# EAGLE design H3_MIDIController_Rev_3_MainBoard (EAGLE 7.6.0)
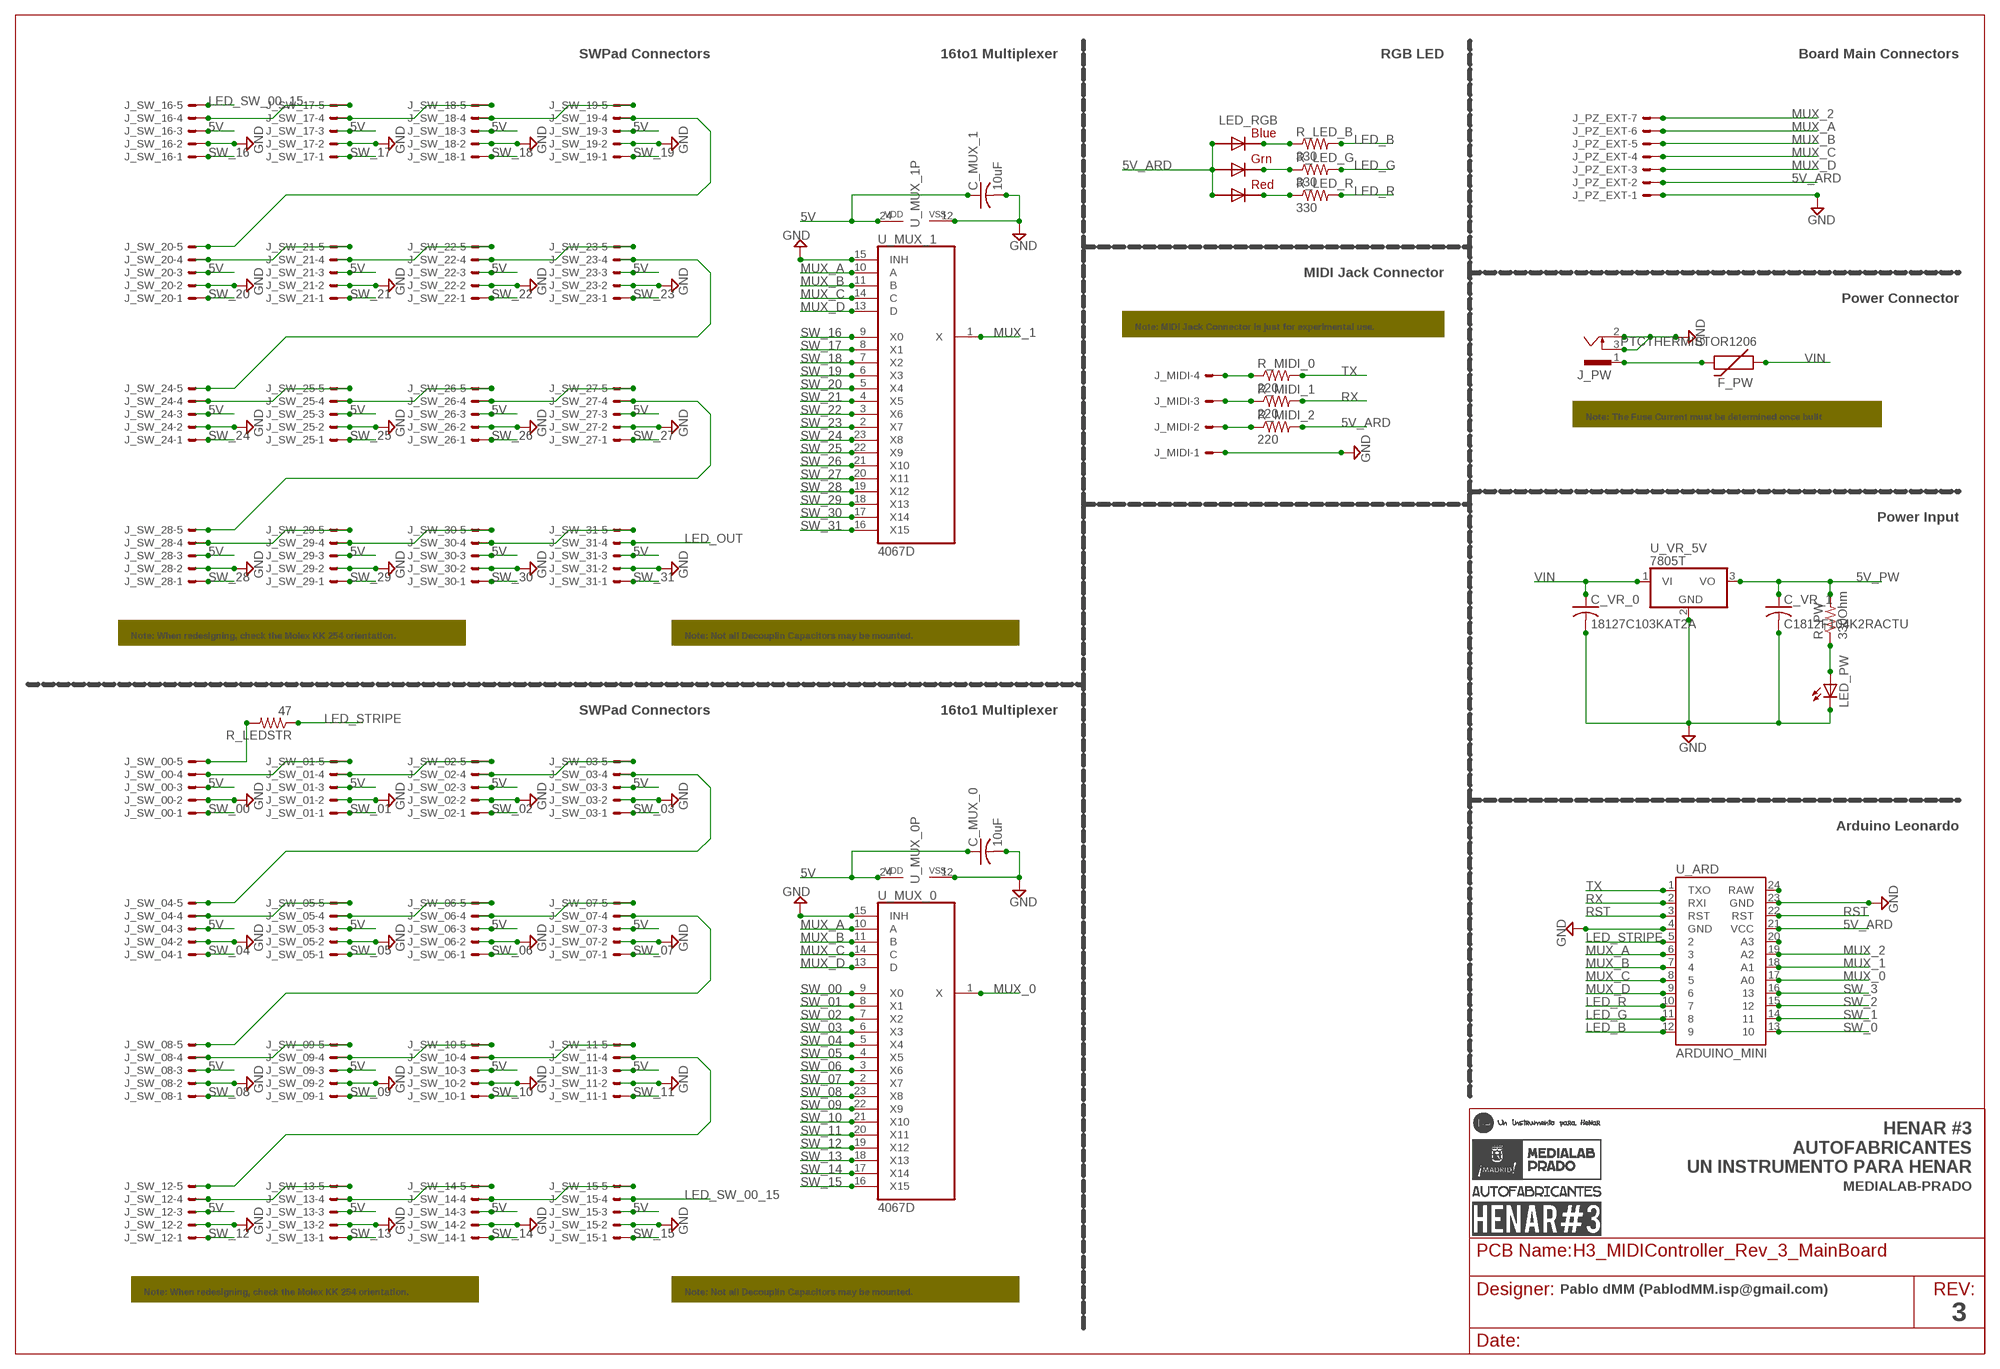
[diagram p0: schematic, sheet 1]

## Parts
C_MUX_0  10uF  C-USC1206K  [C1206K]
C_MUX_1  10uF  C-USC1206K  [C1206K]
C_VR_0  18127C103KAT2A  C-USC1812K  [C1812K]
C_VR_1  C1812F104K2RACTU  C-USC1812K  [C1812K]
F_PW  PTCTHERMISTOR1206  [PTC-1206]
J_MIDI  22-05-7048-04  [7395-04]
J_PW  SCD-014A  [SCD-014-A]
J_PZ_EXT  22-05-7078-07  [7395-07]
J_SW_00  22-05-7058-05  [7395-05]
J_SW_01  22-05-7058-05  [7395-05]
J_SW_02  22-05-7058-05  [7395-05]
J_SW_03  22-05-7058-05  [7395-05]
J_SW_04  22-05-7058-05  [7395-05]
J_SW_05  22-05-7058-05  [7395-05]
J_SW_06  22-05-7058-05  [7395-05]
J_SW_07  22-05-7058-05  [7395-05]
J_SW_08  22-05-7058-05  [7395-05]
J_SW_09  22-05-7058-05  [7395-05]
J_SW_10  22-05-7058-05  [7395-05]
J_SW_11  22-05-7058-05  [7395-05]
J_SW_12  22-05-7058-05  [7395-05]
J_SW_13  22-05-7058-05  [7395-05]
J_SW_14  22-05-7058-05  [7395-05]
J_SW_15  22-05-7058-05  [7395-05]
J_SW_16  22-05-7058-05  [7395-05]
J_SW_17  22-05-7058-05  [7395-05]
J_SW_18  22-05-7058-05  [7395-05]
J_SW_19  22-05-7058-05  [7395-05]
J_SW_20  22-05-7058-05  [7395-05]
J_SW_21  22-05-7058-05  [7395-05]
J_SW_22  22-05-7058-05  [7395-05]
J_SW_23  22-05-7058-05  [7395-05]
J_SW_24  22-05-7058-05  [7395-05]
J_SW_25  22-05-7058-05  [7395-05]
J_SW_26  22-05-7058-05  [7395-05]
J_SW_27  22-05-7058-05  [7395-05]
J_SW_28  22-05-7058-05  [7395-05]
J_SW_29  22-05-7058-05  [7395-05]
J_SW_30  22-05-7058-05  [7395-05]
J_SW_31  22-05-7058-05  [7395-05]
LED_PW  LEDSMT1206  [1206]
LED_RGB  RGBLED5050  [RGBLED5050]
R_LED_B  330  R-US_M1206  [M1206]
R_LED_G  330  R-US_M1206  [M1206]
R_LED_R  330  R-US_M1206  [M1206]
R_LEDSTR  47  R-US_M1206  [M1206]
R_MIDI_0  220  R-US_M1206  [M1206]
R_MIDI_1  220  R-US_M1206  [M1206]
R_MIDI_2  220  R-US_M1206  [M1206]
R_PW  330Ohm  R-US_M1206  [M1206]
U_ARD  ARDUINO_MINI  [ARDUINO_MINI]
U_MUX_0  4067D  [SO24W]
U_MUX_1  4067D  [SO24W]
U_VR_5V  7805T  [TO220H]

## Nets
5V: C_MUX_0.1 C_MUX_1.1 J_SW_00.3 J_SW_01.3 J_SW_02.3 J_SW_03.3 J_SW_04.3 J_SW_05.3 J_SW_06.3 J_SW_07.3 J_SW_08.3 J_SW_09.3 J_SW_10.3 J_SW_11.3 J_SW_12.3 J_SW_13.3 J_SW_14.3 J_SW_15.3 J_SW_16.3 J_SW_17.3 J_SW_18.3 J_SW_19.3 J_SW_20.3 J_SW_21.3 J_SW_22.3 J_SW_23.3 J_SW_24.3 J_SW_25.3 J_SW_26.3 J_SW_27.3 J_SW_28.3 J_SW_29.3 J_SW_30.3 J_SW_31.3 U_MUX_0.24(VDD) U_MUX_1.24(VDD)
5V_ARD: J_PZ_EXT.2 LED_RGB.1(GREEN_A) LED_RGB.2(RED_A) LED_RGB.3(BLUE_A) R_MIDI_2.2 U_ARD.21(VCC)
5V_PW [GND]: C_VR_1.1 R_PW.2 U_VR_5V.3(VO)
GND [GND]: C_MUX_0.2 C_MUX_1.2 C_VR_0.2 C_VR_1.2 J_MIDI.1 J_PW.2 J_PW.3 J_PZ_EXT.1 J_SW_00.2 J_SW_01.2 J_SW_02.2 J_SW_03.2 J_SW_04.2 J_SW_05.2 J_SW_06.2 J_SW_07.2 J_SW_08.2 J_SW_09.2 J_SW_10.2 J_SW_11.2 J_SW_12.2 J_SW_13.2 J_SW_14.2 J_SW_15.2 J_SW_16.2 J_SW_17.2 J_SW_18.2 J_SW_19.2 J_SW_20.2 J_SW_21.2 J_SW_22.2 J_SW_23.2 J_SW_24.2 J_SW_25.2 J_SW_26.2 J_SW_27.2 J_SW_28.2 J_SW_29.2 J_SW_30.2 J_SW_31.2 LED_PW.C U_ARD.4(GND) U_ARD.23(GND) U_MUX_0.12(VSS) U_MUX_0.15(INH) U_MUX_1.12(VSS) U_MUX_1.15(INH) U_VR_5V.2(GND)
LED_B: R_LED_B.2 U_ARD.12
LED_G: R_LED_G.2 U_ARD.11
LED_IN1: J_SW_00.4 J_SW_01.5
LED_IN2: J_SW_01.4 J_SW_02.5
LED_IN3: J_SW_02.4 J_SW_03.5
LED_IN4: J_SW_03.4 J_SW_04.5
LED_IN5: J_SW_04.4 J_SW_05.5
LED_IN6: J_SW_05.4 J_SW_06.5
LED_IN7: J_SW_07.4 J_SW_08.5
LED_IN8: J_SW_08.4 J_SW_09.5
LED_IN9: J_SW_09.4 J_SW_10.5
LED_IN10: J_SW_10.4 J_SW_11.5
LED_IN11: J_SW_11.4 J_SW_12.5
LED_IN12: J_SW_12.4 J_SW_13.5
LED_IN13: J_SW_13.4 J_SW_14.5
LED_IN14: J_SW_14.4 J_SW_15.5
LED_IN15: J_SW_16.4 J_SW_17.5
LED_IN16: J_SW_17.4 J_SW_18.5
LED_IN17: J_SW_18.4 J_SW_19.5
LED_IN18: J_SW_19.4 J_SW_20.5
LED_IN19: J_SW_20.4 J_SW_21.5
LED_IN20: J_SW_21.4 J_SW_22.5
LED_IN21: J_SW_23.4 J_SW_24.5
LED_IN22: J_SW_24.4 J_SW_25.5
LED_IN23: J_SW_25.4 J_SW_26.5
LED_IN24: J_SW_26.4 J_SW_27.5
LED_IN25: J_SW_27.4 J_SW_28.5
LED_IN26: J_SW_28.4 J_SW_29.5
LED_IN27: J_SW_29.4 J_SW_30.5
LED_IN28: J_SW_30.4 J_SW_31.5
LED_OUT: J_SW_31.4
LED_R: R_LED_R.2 U_ARD.10
LED_STRIPE: R_LEDSTR.1 U_ARD.5
LED_SW_00_15: J_SW_15.4 J_SW_16.5
MUX_0: U_ARD.17(A0) U_MUX_0.1(X)
MUX_1: U_ARD.18(A1) U_MUX_1.1(X)
MUX_2: J_PZ_EXT.7 U_ARD.19(A2)
MUX_A: J_PZ_EXT.6 U_ARD.6 U_MUX_0.10(A) U_MUX_1.10(A)
MUX_B: J_PZ_EXT.5 U_ARD.7 U_MUX_0.11(B) U_MUX_1.11(B)
MUX_C: J_PZ_EXT.4 U_ARD.8 U_MUX_0.14(C) U_MUX_1.14(C)
MUX_D: J_PZ_EXT.3 U_ARD.9 U_MUX_0.13(D) U_MUX_1.13(D)
N$1: F_PW.2 J_PW.1
N$2: U_ARD.20(A3)
N$3: U_ARD.24(RAW)
N$4: J_SW_00.5 R_LEDSTR.2
N$5: LED_PW.A R_PW.1
N$7: J_SW_22.4 J_SW_23.5
N$8: LED_RGB.4(BLUE_C) R_LED_B.1
N$9: LED_RGB.6(GREEN_C) R_LED_G.1
N$10: LED_RGB.5(RED_C) R_LED_R.1
N$15: J_MIDI.2 R_MIDI_2.1
N$16: J_MIDI.3 R_MIDI_1.1
N$17: J_MIDI.4 R_MIDI_0.1
N$31: J_SW_06.4 J_SW_07.5
RST: U_ARD.3(RST) U_ARD.22(RST)
RX: R_MIDI_1.2 U_ARD.2(RXI)
SW_0: U_ARD.13
SW_00: J_SW_00.1 U_MUX_0.9(X0)
SW_1: U_ARD.14
SW_01: J_SW_01.1 U_MUX_0.8(X1)
SW_2: U_ARD.15
SW_02: J_SW_02.1 U_MUX_0.7(X2)
SW_3: U_ARD.16
SW_03: J_SW_03.1 U_MUX_0.6(X3)
SW_04: J_SW_04.1 U_MUX_0.5(X4)
SW_05: J_SW_05.1 U_MUX_0.4(X5)
SW_06: J_SW_06.1 U_MUX_0.3(X6)
SW_07: J_SW_07.1 U_MUX_0.2(X7)
SW_08: J_SW_08.1 U_MUX_0.23(X8)
SW_09: J_SW_09.1 U_MUX_0.22(X9)
SW_10: J_SW_10.1 U_MUX_0.21(X10)
SW_11: J_SW_11.1 U_MUX_0.20(X11)
SW_12: J_SW_12.1 U_MUX_0.19(X12)
SW_13: J_SW_13.1 U_MUX_0.18(X13)
SW_14: J_SW_14.1 U_MUX_0.17(X14)
SW_15: J_SW_15.1 U_MUX_0.16(X15)
SW_16: J_SW_16.1 U_MUX_1.9(X0)
SW_17: J_SW_17.1 U_MUX_1.8(X1)
SW_18: J_SW_18.1 U_MUX_1.7(X2)
SW_19: J_SW_19.1 U_MUX_1.6(X3)
SW_20: J_SW_20.1 U_MUX_1.5(X4)
SW_21: J_SW_21.1 U_MUX_1.4(X5)
SW_22: J_SW_22.1 U_MUX_1.3(X6)
SW_23: J_SW_23.1 U_MUX_1.2(X7)
SW_24: J_SW_24.1 U_MUX_1.23(X8)
SW_25: J_SW_25.1 U_MUX_1.22(X9)
SW_26: J_SW_26.1 U_MUX_1.21(X10)
SW_27: J_SW_27.1 U_MUX_1.20(X11)
SW_28: J_SW_28.1 U_MUX_1.19(X12)
SW_29: J_SW_29.1 U_MUX_1.18(X13)
SW_30: J_SW_30.1 U_MUX_1.17(X14)
SW_31: J_SW_31.1 U_MUX_1.16(X15)
TX: R_MIDI_0.2 U_ARD.1(TXO)
VIN: C_VR_0.1 F_PW.1 U_VR_5V.1(VI)

## Notes on the sheet
- SWPad Connectors | 16to1 Multiplexer | RGB LED | Board Main Connectors
- MIDI Jack Connector
- Power Connector
- Note: MIDI Jack Connector is just for experimental use.
- Note: The Fuse Current must be determined once built
- Power Input
- Note: When redesigning, check the Molex KK 254 orientation. | Note: Not all Decouplin Capacitors may be mounted.
- SWPad Connectors | 16to1 Multiplexer
- Arduino Leonardo
- HENAR #3
  AUTOFABRICANTES
  UN INSTRUMENTO PARA HENAR
- MEDIALAB-PRADO
- Note: When redesigning, check the Molex KK 254 orientation. | Note: Not all Decouplin Capacitors may be mounted. | Pablo dMM (PablodMM.isp@gmail.com)
- 3

## Library data of the parts
C_MUX_0 C_MUX_1 C_VR_0 C_VR_1 = adafruit:C-US: CAPACITOR, American symbol
F_PW = SparkFun-PowerIC:PTC: Resettable Fuse PTC Resettable Fuse. Spark Fun Electronics SKU : COM-08357; PROD_ID: RES-08585
J_MIDI = con-molex:22-?-04: CONNECTOR wire to board 2.54 mm (.1 inch) pitch header; OC_FARNELL: unknown; OC_NEWARK: unknown
J_PW = con-shiua-chyuan:SCD-014A: Power Jack 2.5mm; OC_FARNELL: unknown; OC_NEWARK: unknown
J_PZ_EXT = con-molex:22-?-07: CONNECTOR wire to board 2.54 mm (.1 inch) pitch header; OC_FARNELL: unknown; OC_NEWARK: unknown
J_SW_00 J_SW_01-J_SW_09 J_SW_10-J_SW_31 = con-molex:22-?-05: CONNECTOR wire to board 2.54 mm (.1 inch) pitch header; OC_FARNELL: unknown; OC_NEWARK: unknown
LED_PW = adafruit:LED: LED OSRAM: - CHIPLED LG R971, LG N971, LY N971, LG Q971, LY Q971, LO R971, LY R971 LH N974, LH R974 LS Q976, LO Q976, LY Q976 LO Q996 - Hyper CHIPLED LW Q18S LB Q993, LB Q99A, LB R99A - SideLED LS A670, LO A670, LY A670, LG A670, LP A670 LB A673, LV A673, LT A673, LW A673 LH A674 LY A675 LS A676, LA A676, LO A676, LY A676, LW A676 LS A679, LY A679, LG A679 - Hyper Micro SIDELED® LS Y876, LA Y876, LO Y876, LY Y876 LT Y87S - SmartLED LW L88C, LW L88S LB L89C, LB L89S, LG L890 LS L89K, LO L89K, LY L89K LS L896, LA L896, LO L896, LY L896 - TOPLED LS T670, LO T670, LY T670, LG T670, LP T670 LSG T670, LSP T670, LSY T670, LOP T670, LYG T670 LG T671, LOG T671, LSG T671 LB T673, LV T673, LT T673, LW T673 LH T674 LS T676, LA T676, LO T676, LY T676, LB T676, LH T676, LSB T676, LW T676 LB T67C, LV T67C, LT T67C, LS T67K, LO T67K, LY T67K, LW E67C LS E67B, LA E67B, LO E67B, LY E67B, LB E67C, LV E67C, LT E67C LW T67C LS T679, LY T679, LG T679 LS T770, LO T770, LY T770, LG T770, LP T770 LB T773, LV T773, LT T773, LW T773 LH T774 LS E675, LA E675, LY E675, LS T675 LS T776, LA T776, LO T776, LY T776, LB T776 LHGB T686 LT T68C, LB T68C - Hyper Mini TOPLED® LB M676 - Mini TOPLED Santana® LG M470 LS M47K, LO M47K, LY M47K Source: http://www.osram.convergy.de/
LED_RGB = adafruit:RGBLED: For 5050 RGB LEDs, the order of the LEDs may vary from one manufacturer to another!
R_LED_B R_LED_G R_LED_R R_LEDSTR R_MIDI_0 R_MIDI_1 R_MIDI_2 R_PW = adafruit:R-US_: RESISTOR, American symbol
U_ARD = SparkFun-Boards:ARDUINO_MINI: Arduino Pro Mini footprint
U_MUX_0 U_MUX_1 = 40xx:4067: 16-channel ANALOG MULTIPLEXER
U_VR_5V = adafruit:78*: Positive VOLTAGE REGULATOR Added bigger pads to the TO-92 package

## Net classes
1 GND: width 0.635 mm

## Board
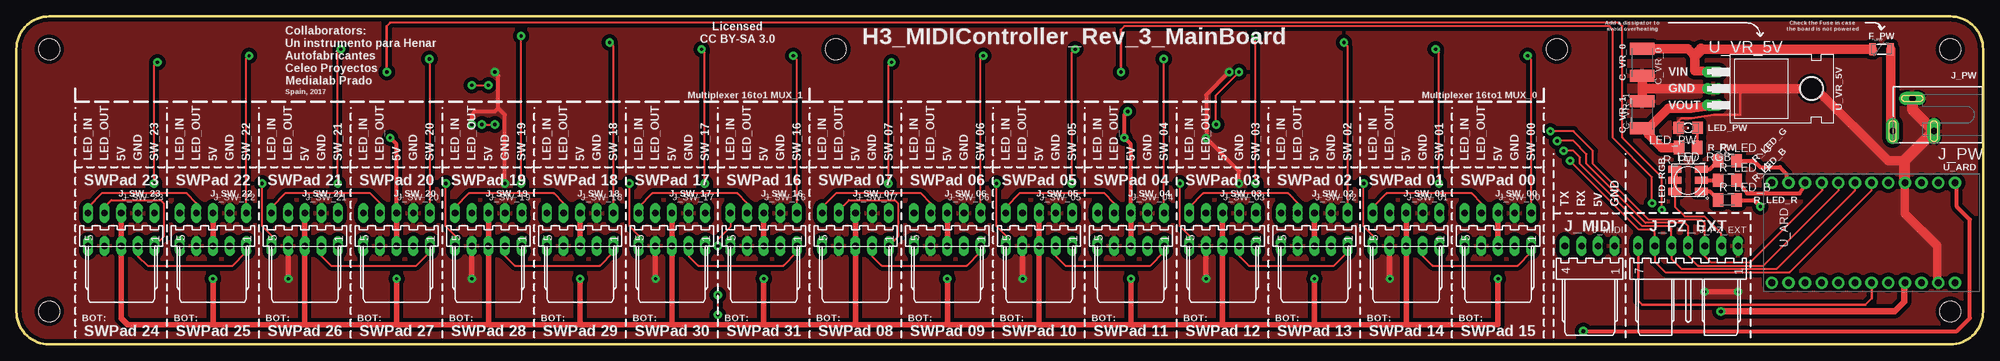
[diagram p1: board, top side]
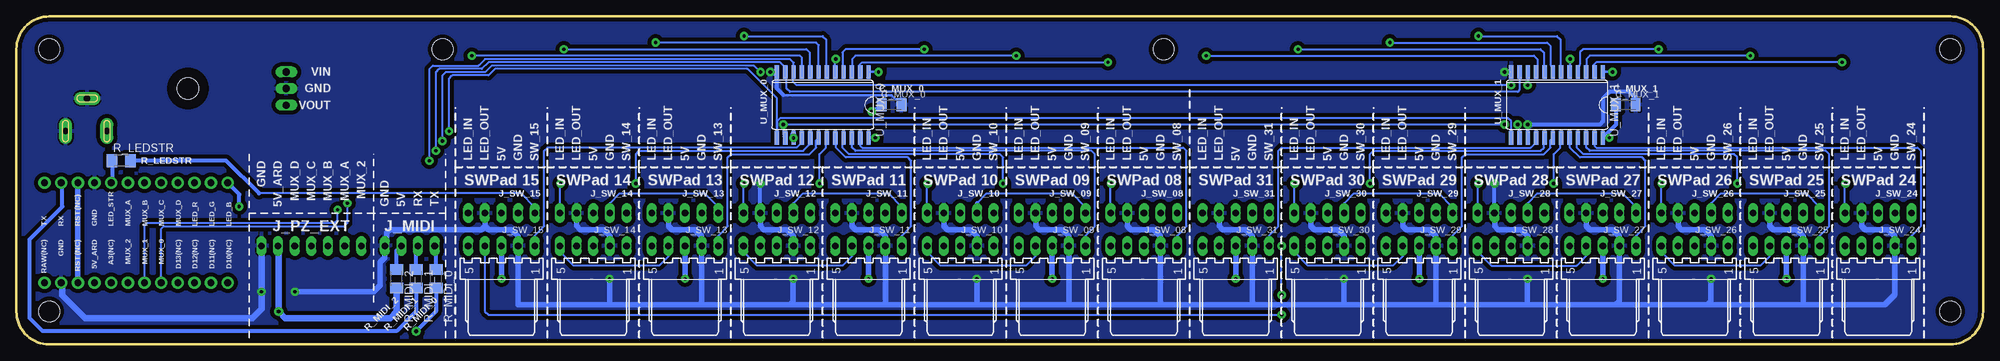
[diagram p2: board, bottom side, seen from below]

Size 300 x 50 mm. Coordinates in mm from the lower left corner, seen from the top.
Outline: 5,0 295,0 arc90 300,5 300,45 arc90 295,50 5,50 arc90 0,45 0,5 arc90 5,0
Copper layers (1*16): Top 0.035mm / dielectric 1.5mm / Bottom 0.035mm
Design rules "default *": minimum track width 10mil, minimum drill 25mil, track to track 10mil, track to pad 10mil, pad to pad 10mil, via to via 10mil, smd to smd 8mil, copper to edge 20mil, drill to drill 8mil, minimum pad ring 10mil, minimum via ring 15mil, stop-mask expansion 4mil, vias tented up to drill 0mil, thermal gap 10mil
Holes 3.2 mm at 5,5 5,45 295,45 295,5 235,45 125,45

### Footprints (pad centres in the part's own frame; a part is rotated, then mirrored left to right if it is on the bottom)
C1206K = smd 1.5 x 2: 1 -1.5,0; 2 1.5,0
C1812K = smd 1.8 x 3.7: 1 -2.05,0; 2 2.05,0
PTC-1206 = smd 1 x 1.8: 1 -1.4,0; 2 1.4,0
7395-04 = drill 1.016 long: 1 3.81,0; 2 1.27,0; 3 -1.27,0; 4 -3.81,0
SCD-014-A = drill 1 pad 2 long: 1 -2.5,13.8; 2 -2.5,7.5; 3 2.5,10.8
7395-07 = drill 1.016 long: 1 7.62,0; 2 5.08,0; 3 2.54,0; 4 0,0; 5 -2.54,0; 6 -5.08,0; 7 -7.62,0
7395-05 = drill 1.016 long: 1 5.08,0; 2 2.54,0; 3 0,0; 4 -2.54,0; 5 -5.08,0
1206 = smd 1.6 x 1.803: A -1.422,0; C 1.422,0
RGBLED5050 = smd 2 x 1.1: 1 -2,1.7; 2 -2,0; 3 -2,-1.7; 4 2,-1.7; 5 2,0; 6 2,1.7
M1206 = smd 1.6 x 2: 1 -1.4,0; 2 1.4,0
ARDUINO_MINI = drill 1.016 pad 1.88: 1 -7.62,12.7; 2 -7.62,10.16; 3 -7.62,7.62; 4 -7.62,5.08; 5 -7.62,2.54; 6 -7.62,0; 7 -7.62,-2.54; 8 -7.62,-5.08; 9 -7.62,-7.62; 10 -7.62,-10.16; 11 -7.62,-12.7; 12 -7.62,-15.24; 13 7.62,-15.24; 14 7.62,-12.7; 15 7.62,-10.16; 16 7.62,-7.62; 17 7.62,-5.08; 18 7.62,-2.54; 19 7.62,0; 20 7.62,2.54; 21 7.62,5.08; 22 7.62,7.62; 23 7.62,10.16; 24 7.62,12.7
SO24W = smd 0.66 x 2.032: 1 -6.985,-5.029; 2 -5.715,-5.029; 3 -4.445,-5.029; 4 -3.175,-5.029; 5 -1.905,-5.029; 6 -0.635,-5.029; 7 0.635,-5.029; 8 1.905,-5.029; 9 3.175,-5.029; 10 4.445,-5.029; 11 5.715,-5.029; 12 6.985,-5.029; 13 6.985,5.029; 14 5.715,5.029; 15 4.445,5.029; 16 3.175,5.029; 17 1.905,5.029; 18 0.635,5.029; 19 -0.635,5.029; 20 -1.905,5.029; 21 -3.175,5.029; 22 -4.445,5.029; 23 -5.715,5.029; 24 -6.985,5.029
TO220H = drill 1.118 long: 1 -2.54,-10.16; 2 0,-10.16; 3 2.54,-10.16 | hole 3.302: 0,4.826

### Placement (x,y rotation side)
C_MUX_0  166.5,36.5 0 bottom
C_MUX_1  54.5,36.5 0 bottom
C_VR_0  248,43 270 top
C_VR_1  248,35 90 top
F_PW  284.5,45 0 top
J_MIDI  240,15 0 top
J_PW  300,35 90 top
J_PZ_EXT  255,15 0 top
J_SW_00  226,20 0 top
J_SW_01  212,20 0 top
J_SW_02  198,20 0 top
J_SW_03  184,20 0 top
J_SW_04  170,20 0 top
J_SW_05  156,20 0 top
J_SW_06  142,20 0 top
J_SW_07  128,20 0 top
J_SW_08  128,15 0 bottom
J_SW_09  142,15 0 bottom
J_SW_10  156,15 0 bottom
J_SW_11  170,15 0 bottom
J_SW_12  184,15 0 bottom
J_SW_13  198,15 0 bottom
J_SW_14  212,15 0 bottom
J_SW_15  226,15 0 bottom
J_SW_16  114,20 0 top
J_SW_17  100,20 0 top
J_SW_18  86,20 0 top
J_SW_19  72,20 0 top
J_SW_20  58,20 0 top
J_SW_21  44,20 0 top
J_SW_22  30,20 0 top
J_SW_23  16,20 0 top
J_SW_24  16,15 0 bottom
J_SW_25  30,15 0 bottom
J_SW_26  44,15 0 bottom
J_SW_27  58,15 0 bottom
J_SW_28  72,15 0 bottom
J_SW_29  86,15 0 bottom
J_SW_30  100,15 0 bottom
J_SW_31  114,15 0 bottom
LED_PW  255,33 180 top
LED_RGB  255,25 0 top
R_LED_B  261,22 0 top
R_LED_G  261,28 0 top
R_LED_R  261,25 0 top
R_LEDSTR  284,28 0 bottom
R_MIDI_0  236,10 270 bottom
R_MIDI_1  239,10 270 bottom
R_MIDI_2  242,10 270 bottom
R_PW  255,30 180 top
U_ARD  283,17 270 top
U_MUX_0  177,36.5 180 bottom
U_MUX_1  65,36.5 180 bottom
U_VR_5V  269,39 270 top

### Tracks (layer width: path | path; a pad name or v marks a point on that pad's centre or on a via)
5V  (via drill 0.5 pad 0.25)
  Top 0.305: J_SW_07.3 J_SW_08.3
  Top 0.61: v169.5,35.5 169,35 v169,31.5 170,30.5 J_SW_04.3 | J_SW_20.3 58,30.5 v57,31.5
  Top 0.813: J_SW_14.3 J_SW_01.3 212,3 | J_SW_12.3 J_SW_03.3 184,3 | J_SW_10.3 J_SW_05.3 156,3 | J_SW_30.3 J_SW_17.3 100,3 | J_SW_28.3 J_SW_19.3 72,3 | J_SW_26.3 J_SW_21.3 44,3 | J_SW_23.3 J_SW_24.3 16,4 17,3 30,3 | 212,3 226,3 v226,10 | 212,3 198,3 | 198,3 184,3 | 184,3 170,3 | 170,3 156,3 | 156,3 142,3 | 142,3 128,3 | 128,3 114,3 | 114,3 100,3 | 100,3 86,3 | 86,3 72,3 | 72,3 58,3 | 58,3 44,3 | 44,3 30,3 | J_SW_22.3 J_SW_25.3 | v30,10 30,3 | J_SW_20.3 J_SW_27.3 | v58,10 58,3 | J_SW_18.3 J_SW_29.3 | v86,10 86,3 | J_SW_16.3 J_SW_31.3 | v114,10 114,3 | J_SW_07.3 128,3 | J_SW_06.3 J_SW_09.3 | v142,10 142,3 | J_SW_04.3 J_SW_11.3 | v170,10 170,3 | J_SW_02.3 J_SW_13.3 | v198,10 198,3 | J_SW_00.3 J_SW_15.3
  Bottom 0.406: U_MUX_0.24 169.03,31.47 v169,31.5 | 57.99,31.5 U_MUX_1.24
  Bottom 0.61: C_MUX_1.1 56,33.49 U_MUX_1.24 | v169.5,35.5 C_MUX_0.1 | v57,31.5 57.99,31.5
  Bottom 0.813: J_SW_25.3 v30,10 | J_SW_27.3 v58,10 | J_SW_29.3 v86,10 | J_SW_31.3 v114,10 | J_SW_09.3 v142,10 | J_SW_11.3 v170,10 | J_SW_13.3 v198,10 | J_SW_15.3 v226,10
  other vias: 30,15 58,15 86,15 114,15 142,15 170,15 198,15
5V_ARD  (via drill 0.6)
  Top 0.305: LED_RGB.3 253,21 254.5,19.5 257.5,19.5 260,17 260,15.08 J_PZ_EXT.2
  Top 0.61: LED_RGB.2 LED_RGB.3
  Top 0.813: LED_RGB.1 LED_RGB.2
  Top 1.016: v260,5 286.5,5 288,6.5 288,9.3 U_ARD.21
  Bottom 1.016: R_MIDI_2.2 242,5 243,4 259,4 v260,5 260,14.92 J_PZ_EXT.2
5V_PW
  Top 1.422: C_VR_1.1 248.95,32.95 | 248.95,32.95 252,36 255.38,36 U_VR_5V.3 | 248.95,32.95 248.95,32.05 251,30 R_PW.2
GND  (via drill 0.5 pad 0.25)  (1 unrouted)
  Top 0.305: LED_PW.C 253.58,34.08 254,34.5
  Top 0.406: U_VR_5V.2 258,39 | 263,39 263,35 259,35 255.5,34.5 254,34.5 253.5,34 253.5,33.08 LED_PW.C | 73.5,41 v73,41.5
  Top 0.61: v69.5,33.5 69.5,35 70,35.5 73,35.5 73.5,36 | 73.5,36 73.5,41 | v184.99,41.53 181.5,38.04 181.5,31.53 | v74.5,24.5 74.5,35 73.5,36 | v186.5,24.5 186.5,26.42 U_MUX_0.15
  Top 0.813: J_SW_26.2 41.46,10.04 v41.5,10 | J_SW_28.2 69.46,10.04 v69.5,10 | J_SW_30.2 97.46,10.04 v97.5,10 | J_SW_10.2 153.46,10.04 v153.5,10 | J_SW_12.2 181.46,10.04 v181.5,10 | J_SW_14.2 209.46,10.04 v209.5,10 | v257.5,8 v262.62,8 | 181.5,31.53 U_MUX_0.15
  Top 1.27: U_ARD.4 288.08,19.92 293,15 293,9.54 U_ARD.23
  Top 1.422: C_VR_0.2 248,39 | 248,39 C_VR_1.2 | U_VR_5V.2 248,39 | 258,39 263,39 274.5,39 285.5,28 288,28 288.08,28.08
  Top 1.676: J_PW.3 289.2,35.8 J_PW.2 288.08,28.08 U_ARD.4
  Bottom 0.406: v73,41.5 72.01,41.5 U_MUX_1.12 | C_MUX_1.2 53,37.5 | C_MUX_0.2 166.5,38 183,38 | v184.99,41.53 184,41.51 184,41 183.99,41.02 | 181.47,31.47 181.5,31.5 | v69.5,33.5 69.5,31.53 U_MUX_1.15 69.44,33.45 v69.5,33.5
  Bottom 0.61: v69.5,33.5 58.5,33.5 58,34 58,37.5 57,38.5 54,38.5 53,37.5 | 183,38 184,39 184,41 | v184.99,41.53 183.99,41.02 | J_SW_19.2 74.54,24.46 v74.5,24.5 | J_SW_03.2 186.54,24.46 v186.5,24.5
  Bottom 0.813: 209.5,6 223.5,6 223.46,6.04 J_SW_15.2 223.46,16.46 224.5,17.5 228,17.5 228.5,18 | 209.5,6 195.5,6 | 195.5,6 182,6 | 182,6 167.5,6 | 167.5,6 153.5,6 | 153.5,6 139.5,6 | 139.5,6 125.5,6 | 125.5,6 111.5,6 | 111.5,6 97.5,6 | 97.5,6 83.5,6 | 83.5,6 69.5,6 | 69.5,6 56,6 | 56,6 42,6 | 42,6 27.5,6 | 27.5,6 15,6 13.46,7.54 J_SW_24.2 13.46,16.46 14.5,17.5 18,17.5 18.5,18 18.5,19.96 J_SW_23.2 | 27.5,6 27.46,6.04 J_SW_25.2 27.46,16.46 28.5,17.5 32,17.5 32.5,18 32.5,19.96 J_SW_22.2 | v41.5,10 41.5,6.5 42,6 | 56,6 55.46,6.54 J_SW_27.2 55.46,16.46 56.5,17.5 60,17.5 60.5,18 60.5,19.96 J_SW_20.2 | v69.5,10 69.5,6 | 83.5,6 83.46,6.04 J_SW_29.2 83.46,16.46 84.5,17.5 88,17.5 88.5,18 88.5,19.96 J_SW_18.2 | v97.5,10 97.5,6 | 111.5,6 111.46,6.04 J_SW_31.2 111.46,16.46 112.5,17.5 116,17.5 116.5,18 116.5,19.96 J_SW_16.2 | 125.5,6 125.46,6.04 J_SW_08.2 125.46,16.46 126.5,17.5 130,17.5 130.5,18 130.5,19.96 J_SW_07.2 | 139.5,6 139.46,6.04 J_SW_09.2 139.46,16.46 140.5,17.5 144,17.5 144.5,18 144.5,19.96 J_SW_06.2 | v153.5,10 153.5,6 | 167.5,6 167.46,6.04 J_SW_11.2 167.46,16.46 168.5,17.5 172,17.5 172.5,18 172.5,19.96 J_SW_04.2 | v181.5,10 181.5,6.5 182,6 | 195.5,6 195.46,6.04 J_SW_13.2 195.46,16.46 196.5,17.5 200,17.5 200.5,18 200.5,19.96 J_SW_02.2 | v209.5,10 209.5,6 | J_SW_26.2 41.46,16.46 42.5,17.5 46,17.5 46.5,18 46.5,19.96 J_SW_21.2 | J_SW_28.2 69.46,16.46 70.5,17.5 74,17.5 74.5,18 74.5,19.96 J_SW_19.2 | J_SW_30.2 97.46,16.46 98.5,17.5 102,17.5 102.5,18 102.5,19.96 J_SW_17.2 | J_SW_10.2 153.46,16.46 154.5,17.5 158,17.5 158.5,18 158.5,19.96 J_SW_05.2 | J_SW_12.2 181.46,16.46 182.5,17.5 186,17.5 186.5,18 186.5,19.96 J_SW_03.2
  Bottom 0.813: J_SW_01.2 214.54,18.04 214,17.5 210.5,17.5 209.46,16.46 J_SW_14.2 | 228.5,18 228.5,19.96 J_SW_00.2 | 228.5,18 229,17.5 243,17.5 243.5,17 243.5,15.31 J_MIDI.1 243.81,13.19 244.5,12.5 244.5,9 245.5,8 v257.5,8 | U_MUX_0.15 181.44,31.95 181.5,32
  Bottom 1.016: J_PZ_EXT.1 v262.62,8 262.62,5.38 264,4 289.5,4 293,7.5 293,9.22 U_ARD.23
  other vias: 181.44,31.47
  pour Top (isolate 0.61): 5,0 295,0 arc90 300,5 300,45 arc90 295,50 5,50 arc90 0,45 0,5 arc90
  pour Bottom (isolate 0.61): 5,50 arc90 0,45 0,5 arc90 5,0 295,0 arc90 300,5 300,45 arc90 295,50
LED_B  (via drill 0.5)
  Top 0.61: R_LED_B.2 265,22 v266,21
  Bottom 0.61: v266,21 266,22.86 U_ARD.12
LED_G
  Top 0.61: R_LED_G.2 265,28 266,27 269,27 270,26 270,24.92 U_ARD.11
LED_IN1
  Top 0.305: J_SW_00.4 223.46,21.54 222,23 209,23 207,21 207,20.08
  Top 0.61: 207,20.08 J_SW_01.5
LED_IN2
  Bottom 0.305: J_SW_01.4 209.46,21.54 208,23 195,23 193,21 193,20.08
  Bottom 0.61: 193,20.08 J_SW_02.5
LED_IN3
  Top 0.305: J_SW_02.4 195.46,21.54 194,23 181,23 179,21 179,19.92
  Top 0.61: 179,19 179,19.92 J_SW_03.5
LED_IN4
  Bottom 0.305: J_SW_03.4 181.46,21.54 180,23 167,23 165,21 165,20.08
  Bottom 0.61: 165,20.08 J_SW_04.5
LED_IN5
  Top 0.305: J_SW_04.4 167.46,21.54 166,23 153,23 151,21 151,20.08
  Top 0.61: 151,20.08 J_SW_05.5
LED_IN6
  Bottom 0.305: 153.46,21.54 152,23 139,23 137,21 137,20.08
  Bottom 0.61: J_SW_05.4 153.46,21.54 | 137,20.08 J_SW_06.5
LED_IN7
  Top 0.305: 125.46,20.46 127,22 134,22 134.5,21.5 134.5,16.42 J_SW_08.5
  Top 0.61: J_SW_07.4 125.46,20.46
LED_IN8
  Top 0.305: J_SW_08.4 130.54,13.46 132,12 145,12 147,14 147,14.92 J_SW_09.5
LED_IN9
  Bottom 0.305: J_SW_09.4 144.54,13.46 146,12 159,12 161,14
  Bottom 0.61: 161,14 161,14.92 J_SW_10.5
LED_IN10
  Top 0.305: J_SW_10.4 158.54,13.46 160,12 173,12 175,14 175,14.92
  Top 0.61: 175,14.92 J_SW_11.5
LED_IN11
  Bottom 0.305: J_SW_11.4 172.54,13.46 174,12 187,12 189,14 189,14.92
  Bottom 0.61: 189,14.92 J_SW_12.5
LED_IN12
  Top 0.305: J_SW_12.4 186.54,13.46 188,12 201,12 203,14
  Top 0.61: 203,14 203,14.92 J_SW_13.5
LED_IN13
  Bottom 0.305: J_SW_13.4 200.54,13.46 202,12 215,12 217,14
  Bottom 0.61: 217,14 217,14.92 J_SW_14.5
LED_IN14
  Top 0.305: J_SW_14.4 214.54,13.46 216,12 229,12 231,14
  Top 0.61: 231,14 231,14.92 J_SW_15.5
LED_IN15
  Top 0.305: J_SW_16.4 111.46,21.54 110,23 97,23 95,21 95,19.92 95,19
  Top 0.61: 95,19.92 J_SW_17.5
LED_IN16
  Bottom 0.305: J_SW_17.4 97.46,21.54 96,23 83,23 81,21 81,20.08
  Bottom 0.61: 81,20.08 J_SW_18.5
LED_IN17
  Top 0.305: J_SW_18.4 83.46,21.54 82,23 69,23 67,21
  Top 0.61: 67,21 67,20.08 J_SW_19.5
LED_IN18
  Bottom 0.305: J_SW_19.4 69.46,21.54 68,23 55,23 53,21
  Bottom 0.61: 53,21 53,20.08 J_SW_20.5
LED_IN19
  Top 0.305: J_SW_20.4 55.46,21.54 54,23 41,23 39,21
  Top 0.61: 39,21 39,20.08 J_SW_21.5
LED_IN20
  Bottom 0.305: J_SW_21.4 41.46,21.54 40,23 27,23 25,21
  Bottom 0.61: 25,21 25,20.08 J_SW_22.5
LED_IN21
  Top 0.305: J_SW_23.4 13.46,20.96 14.5,22 22,22 22.5,21.5 22.5,16.42 J_SW_24.5
LED_IN22
  Top 0.305: J_SW_24.4 18.54,13.46 20,12 33,12 35,14 35,14.92 J_SW_25.5
LED_IN23
  Bottom 0.305: J_SW_25.4 32.54,13.46 34,12 47,12 49,14 49,14.92 J_SW_26.5
LED_IN24
  Top 0.305: J_SW_27.5 63.08,14.08 61,12 48,12 46.54,13.46 J_SW_26.4
LED_IN25
  Bottom 0.305: J_SW_28.5 77.08,14.08 75,12 62,12 60,14 60,14.46 J_SW_27.4
LED_IN26
  Top 0.305: J_SW_28.4 74.54,13.46 76,12 89,12 91,14 91,14.92 J_SW_29.5
LED_IN27
  Bottom 0.305: J_SW_29.4 88.54,13.46 90,12 103,12 105,14 105,14.92 J_SW_30.5
LED_IN28
  Top 0.305: J_SW_30.4 102.54,13.46 104,12 117,12 119,14 119,14.92
  Top 0.61: 119,14.92 J_SW_31.5
LED_R
  Top 0.61: R_LED_R.2 264,23 272,23 273,24.46 U_ARD.10
LED_STRIPE
  Bottom 0.61: R_LEDSTR.1 285.4,24.76 U_ARD.5
LED_SW_00_15  (via drill 0.5 pad 0.25)
  Top 0.305: v107,4.5 v107,7.5 | v107,15 107,16 109,18 109,19.92 J_SW_16.5
  Bottom 0.305: J_SW_15.4 228.54,5.04 228,4.5 v107,4.5 | v107,7.5 v107,15
MUX_0  (via drill 0.5 pad 0.25)
  Top 0.305: v249.5,21.5 249.5,25.5 243.5,31.5 243.5,48 243,48.5 169,48.5 168.5,48
  Top 0.406: v168.5,41.5 168.5,48
  Bottom 0.305: U_ARD.17 277.92,17.58 277.5,18 250,18 249.5,18.5 v249.5,21.5
  Bottom 0.406: U_MUX_0.1 168.53,41.53 v168.5,41.5
MUX_1  (via drill 0.5 pad 0.25)
  Top 0.305: v251,20.5 251,25.5 245,31.5 245,48.5 244.5,49 57,49
  Top 0.406: v56.5,41.5 56.5,48.5 57,49
  Bottom 0.305: U_ARD.18 280.46,18.04 280,18.5 251.5,18.5 251,19 v251,20.5
  Bottom 0.406: U_MUX_1.1 56.53,41.53 v56.5,41.5
MUX_2
  Top 0.406: J_PZ_EXT.7 247.38,6.62 248,6 282,6 283,7 U_ARD.19
MUX_A  (via drill 0.5 pad 0.25)
  Top 0.305: U_ARD.6 283,23.5 270.5,11 251.5,11 249.92,12.58 J_PZ_EXT.6 249.92,17.08 249.5,17.5 247.5,17.5 v237,28 | v69.5,39.5 v72,39.5
  Bottom 0.305: U_MUX_1.10 69.44,39.55 v69.5,39.5 | v72,39.5 181,39.5 181.5,40 181.5,41.47 U_MUX_0.10 181.44,42.95 182,43.5 228.5,43.5 229.5,42.5 236.5,42.5 237,42 v237,28
MUX_B  (via drill 0.5 pad 0.25)
  Top 0.305: U_ARD.7 280.5,24.58 280.5,23.5 268.5,11.5 254,11.5 252.46,13.04 J_PZ_EXT.5 252.46,17.54 252,18 248,18 238.5,27.5 238.5,28.5 237.5,29.5 v236,29.5
  Bottom 0.305: U_MUX_1.11 70.72,38.78 71,38.5 182,38.5 182.5,39 182.5,41.31 U_MUX_0.11 182.72,42.22 183.5,43 228,43 229,42 235.5,42 236,41.5 v236,29.5
MUX_C  (via drill 0.5 pad 0.25)
  Top 0.305: U_ARD.8 278,24.54 278,23.5 266.5,12 256.5,12 255,13.5 J_PZ_EXT.4 255,18 254.5,18.5 248.5,18.5 239.5,27.5 239.5,29 237.5,31 v235,31 | v71,33.5 v73,33.5 | v183,33.5 183,38 v186.5,41.5
  Bottom 0.305: U_MUX_1.14 70.72,33.22 v71,33.5 | v73,33.5 v183,33.5 183,32 | 183,32 183,31.69 U_MUX_0.14 182.72,31.71 183,32 | v186.5,41.5 187.5,42.5 227.5,42.5 228.5,41.5 234.5,41.5 235,41 v235,31
MUX_D  (via drill 0.5 pad 0.25)
  Top 0.305: U_ARD.9 275.5,24.5 275.5,23.5 264.5,12.5 258.5,12.5 257.54,13.46 J_PZ_EXT.3 257.54,18.46 257,19 249,19 240.5,27.5 240.5,29.5 237.5,32.5 v234,32.5
  Bottom 0.305: U_MUX_1.13 71.98,33.98 72.5,34.5 183.5,34.5 184,34 | 184,34 184,31.49 U_MUX_0.13 183.99,33.98 184,34 | 184,34 184,37.5 188.5,42 227,42 228,41 233.5,41 234,40.5 v234,32.5
N$1
  Top 1.422: F_PW.2 285.9,32.8 J_PW.1
N$4
  Bottom 0.305: J_SW_00.5 220.92,20.92 223,23 263,23
  Bottom 0.61: 263,23 268,28 R_LEDSTR.2
N$5
  Top 0.406: R_PW.1 256.4,32.98 LED_PW.A
N$6
  pour Top (isolate 0.61): 0,5 arc90 5,0 295,0 arc90 300,5 300,45 arc90 295,50 5,50 arc90 0,45
N$7
  Top 0.305: J_SW_22.4 27.46,21.54 26,23 13,23 11,21 11,20.08
  Top 0.61: 11,20.08 J_SW_23.5
N$8
  Top 0.61: LED_RGB.4 258.3,23.3 R_LED_B.1
N$9
  Top 0.61: LED_RGB.6 258.3,26.7 R_LED_G.1
N$10
  Top 0.61: LED_RGB.5 R_LED_R.1
N$11
  pour Bottom (isolate 0.61): 5,50 arc90 0,45 0,5 arc90 5,0 295,0 arc90 300,5 300,45 arc90 295,50
N$15
  Bottom 0.61: R_MIDI_2.1 242,14.27 J_MIDI.2
N$16
  Bottom 0.61: R_MIDI_1.1 239,14.73 J_MIDI.3
N$17
  Bottom 0.61: R_MIDI_0.1 236,14.81 J_MIDI.4
N$31
  Top 0.305: J_SW_06.4 139.46,21.54 138,23 125,23 123,21 123,20.08
  Top 0.61: 123,20.08 J_SW_07.5
RST
  Bottom 0.813: U_ARD.22 U_ARD.3
RX
  Bottom 0.61: R_MIDI_1.2 239,5 242,2 296,2 298,4 298,16 293,21 293,24.46 U_ARD.2
SW_00  (via drill 0.5 pad 0.25)
  Top 0.305: v230.5,44 231,43.5 231,20.08 J_SW_00.1
  Bottom 0.305: U_MUX_0.9 180.18,43.67 180.5,44 v230.5,44
SW_01  (via drill 0.5 pad 0.25)
  Top 0.305: v217,24.5 217,44.5 v216.5,45
  Bottom 0.305: J_SW_01.1 217.08,24.42 v217,24.5 | v216.5,45 179.5,45 179,44.5 179,41.62 U_MUX_0.8
SW_02  (via drill 0.5 pad 0.25)
  Top 0.305: v202.5,46 203,45.5 203,20.08 J_SW_02.1
  Bottom 0.305: U_MUX_0.7 177.63,45.63 178,46 v202.5,46
SW_03  (via drill 0.5 pad 0.25)
  Top 0.305: v189,24.5 v189,47
  Bottom 0.305: J_SW_03.1 189.08,24.42 v189,24.5 | v189,47 177,47 176.5,46.5 176.5,41.66 U_MUX_0.6
SW_04  (via drill 0.5 pad 0.25)
  Top 0.305: v175,43.5 175,20.08 J_SW_04.1
  Bottom 0.305: U_MUX_0.5 175.09,43.41 v175,43.5
SW_05  (via drill 0.5 pad 0.25)
  Top 0.305: v161,24.5 161,44.5 v161.5,45
  Bottom 0.305: J_SW_05.1 161.08,24.42 v161,24.5 | v161.5,45 173.5,45 174,44.5 174,41.7 U_MUX_0.4
SW_06  (via drill 0.5 pad 0.25)
  Top 0.305: J_SW_06.1 147.08,43.58 v147.5,44
  Bottom 0.305: v147.5,44 172,44 172.5,43.5 172.5,41.58 U_MUX_0.3
SW_07  (via drill 0.5 pad 0.25)
  Top 0.305: v133,24.5 133,42.5 v133.5,43
  Bottom 0.305: J_SW_07.1 133.08,24.42 v133,24.5 | U_MUX_0.2 171.28,42.72 171,43 v133.5,43
SW_08
  Bottom 0.305: U_MUX_0.23 171.28,30.29 171,30 122,30 121.5,29.5 121.5,18 122.92,16.58 J_SW_08.1
SW_09
  Bottom 0.305: J_SW_09.1 136.92,16.58 135.5,18 135.5,29 136,29.5 172,29.5 172.5,30 172.5,31.42 U_MUX_0.22
SW_10  (via drill 0.5 pad 0.25)
  Top 0.305: J_SW_10.1 150.92,16.58 149.5,18 v149.5,24.5
  Bottom 0.305: v149.5,24.5 149.5,28.5 150,29 173,29 174,30 174,31.3 U_MUX_0.21
SW_11
  Bottom 0.305: J_SW_11.1 164.92,16.58 163.5,18 163.5,28 164,28.5 173.5,28.5 175,30 175,31.38 U_MUX_0.20
SW_12  (via drill 0.5 pad 0.25)
  Top 0.305: J_SW_12.1 178.92,16.58 177.5,18 v177.5,24.5
  Bottom 0.305: v177.5,24.5 177.5,29 176.5,30 176.5,31.34 U_MUX_0.19
SW_13
  Bottom 0.305: J_SW_13.1 192.92,16.58 191.5,18 191.5,28.5 191,29 179,29 178,30 178,31.11 U_MUX_0.18
SW_14  (via drill 0.5 pad 0.25)
  Top 0.305: J_SW_14.1 206.92,16.58 205.5,18 v205.5,24.5
  Bottom 0.305: v205.5,24.5 205.5,29 205,29.5 180,29.5 179,30.5 179,31.38 U_MUX_0.17
SW_15
  Bottom 0.305: U_MUX_0.16 180.18,30.82 181,30 219,30 219.5,29.5 219.5,18 220.92,16.58 J_SW_15.1
SW_16  (via drill 0.5 pad 0.25)
  Top 0.305: J_SW_16.1 119.08,43.42 v118.5,44
  Bottom 0.305: v118.5,44 68.5,44 68,43.5 68,41.7 U_MUX_1.9
SW_17  (via drill 0.5 pad 0.25)
  Top 0.305: v105,24.5 105,44.5 v104.5,45
  Bottom 0.305: J_SW_17.1 105.08,24.42 v105,24.5 | v104.5,45 67.5,45 67,44.5 67,41.62 U_MUX_1.8
SW_18  (via drill 0.5 pad 0.25)
  Top 0.305: J_SW_18.1 91.08,45.42 v90.5,46
  Bottom 0.305: v90.5,46 66.5,46 66,45.5 66,42.66 U_MUX_1.7
SW_19  (via drill 0.5 pad 0.25)
  Top 0.305: v77,24.5 v77,47
  Bottom 0.305: J_SW_19.1 77.08,24.42 v77,24.5 | v77,47 65,47 64.5,46.5 64.5,42.16 U_MUX_1.6
SW_20  (via drill 0.5 pad 0.25)
  Top 0.305: J_SW_20.1 63.08,43.42 v63,43.5
  Bottom 0.305: v63,43.5 63,41.62 U_MUX_1.5
SW_21  (via drill 0.5 pad 0.25)
  Top 0.305: v49,24.5 49,44.5 v49.5,45
  Bottom 0.305: J_SW_21.1 49.08,24.42 v49,24.5 | v49.5,45 61,45 61.5,44.5 61.5,42.85 U_MUX_1.4
SW_22  (via drill 0.5 pad 0.25)
  Top 0.305: J_SW_22.1 35.08,43.58 v35.5,44
  Bottom 0.305: v35.5,44 60,44 60.5,43.5 60.5,41.58 U_MUX_1.3
SW_23  (via drill 0.5 pad 0.25)
  Top 0.305: v21,24.5 21,42.5 v21.5,43
  Bottom 0.305: J_SW_23.1 21.08,24.42 v21,24.5 | v21.5,43 59,43 59.5,42.5 59.5,41.81 U_MUX_1.2
SW_24
  Bottom 0.305: U_MUX_1.23 59.28,30.29 59,30 10,30 9.5,29.5 9.5,18 10.92,16.58 J_SW_24.1
SW_25
  Bottom 0.305: J_SW_25.1 24.92,16.58 23.5,18 23.5,29 24,29.5 60,29.5 60.5,30 60.5,31.42 U_MUX_1.22
SW_26  (via drill 0.5 pad 0.25)
  Top 0.305: J_SW_26.1 38.92,16.58 37.5,18 v37.5,24.5
  Bottom 0.305: v37.5,24.5 37.5,28.5 38,29 61,29 62,30 62,31.3 U_MUX_1.21
SW_27
  Bottom 0.305: J_SW_27.1 52.92,16.58 51.5,18 51.5,28 52,28.5 61.5,28.5 63,30 63,31.38 U_MUX_1.20
SW_28  (via drill 0.5 pad 0.25)
  Top 0.305: J_SW_28.1 66.92,16.58 65.5,18 v65.5,24.5
  Bottom 0.305: U_MUX_1.19 64.5,31.34 64.5,30 65.5,29 v65.5,24.5
SW_29
  Bottom 0.305: J_SW_29.1 80.92,16.58 79.5,18 79.5,28.5 79,29 67,29 66,30 66,31.11 U_MUX_1.18
SW_30  (via drill 0.5 pad 0.25)
  Top 0.305: J_SW_30.1 94.92,16.58 93.5,18 v93.5,24.5
  Bottom 0.305: v93.5,24.5 93.5,29 93,29.5 67.5,29.5 67,30 67,31.38 U_MUX_1.17
SW_31
  Bottom 0.305: U_MUX_1.16 68.17,30.82 69,30 107,30 107.5,29.5 107.5,18 108.92,16.58 J_SW_31.1
TX  (via drill 0.6)
  Top 0.61: v239,2 296,2 298,4 298,19 296,21 296,24.32 U_ARD.1
  Bottom 0.61: R_MIDI_0.2 236,5 v239,2
VIN
  Top 1.422: C_VR_0.1 254.95,45.05 256,44 256,41.7 U_VR_5V.1 | 257,45 F_PW.1
  Top 1.676: 257,45 256,44

### Text on the board
t_Silk: Licensed / CC BY-SA 3.0 | Add a dissipator to / avoid overheating | Check the Fuse in case / the board is not powered | H3_MIDIController_Rev_3_MainBoard | F_PW | Collaborators: / Un instrumento para Henar / Autofabricantes / Celeo Proyectos / Medialab Prado | C_VR_0 | J_PW | VIN / GND / VOUT | U_VR_5V | Spain, 2017 | Multiplexer 16to1 MUX_1 | Multiplexer 16to1 MUX_0 | C_VR_1 | LED_PW | R_PW | LED_IN / LED_OUT / 5V / GND / SW_23 | LED_IN / LED_OUT / 5V / GND / SW_22 | LED_IN / LED_OUT / 5V / GND / SW_21 | LED_IN / LED_OUT / 5V / GND / SW_20 | LED_IN / LED_OUT / 5V / GND / SW_19 | LED_IN / LED_OUT / 5V / GND / SW_18 | LED_IN / LED_OUT / 5V / GND / SW_17 | LED_IN / LED_OUT / 5V / GND / SW_16 | LED_IN / LED_OUT / 5V / GND / SW_07 | LED_IN / LED_OUT / 5V / GND / SW_06 | LED_IN / LED_OUT / 5V / GND / SW_05 | LED_IN / LED_OUT / 5V / GND / SW_04 | LED_IN / LED_OUT / 5V / GND / SW_03 | LED_IN / LED_OUT / 5V / GND / SW_02 | LED_IN / LED_OUT / 5V / GND / SW_01 | LED_IN / LED_OUT / 5V / GND / SW_00 | R_LED_G | U_ARD | SWPad 23 | SWPad 22 | SWPad 21 | SWPad 20 | SWPad 19 | SWPad 18 | SWPad 17 | SWPad 16 | SWPad 07 | SWPad 06 | SWPad 05 | SWPad 04 | SWPad 03 | SWPad 02 | SWPad 01 | SWPad 00 | LED_RGB | R_LED_B | J_SW_23 | J_SW_22 | J_SW_21 | J_SW_20 | J_SW_19 | J_SW_18 | J_SW_17 | J_SW_16 | J_SW_07 | J_SW_06 | J_SW_05 | J_SW_04 | J_SW_03 | J_SW_02 | J_SW_01 | J_SW_00 | R_LED_R | TX / RX / 5V / GND | J_MIDI | J_PZ_EXT | BOT: | BOT: | BOT: | BOT: | BOT: | BOT: | BOT: | BOT: | BOT: | BOT: | BOT: | BOT: | BOT: | BOT: | BOT: | BOT: | SWPad 24 | SWPad 25 | SWPad 26 | SWPad 27 | SWPad 28 | SWPad 29 | SWPad 30 | SWPad 31 | SWPad 08 | SWPad 09 | SWPad 10 | SWPad 11 | SWPad 12 | SWPad 13 | SWPad 14 | SWPad 15
b_Silk: C_MUX_1 | C_MUX_0 | VIN / GND / VOUT | U_MUX_1 | U_MUX_0 | LED_IN / LED_OUT / 5V / GND / SW_24 | LED_IN / LED_OUT / 5V / GND / SW_25 | LED_IN / LED_OUT / 5V / GND / SW_26 | LED_IN / LED_OUT / 5V / GND / SW_29 | LED_IN / LED_OUT / 5V / GND / SW_30 | LED_IN / LED_OUT / 5V / GND / SW_31 | LED_IN / LED_OUT / 5V / GND / SW_08 | LED_IN / LED_OUT / 5V / GND / SW_09 | LED_IN / LED_OUT / 5V / GND / SW_10 | LED_IN / LED_OUT / 5V / GND / SW_13 | LED_IN / LED_OUT / 5V / GND / SW_14 | LED_IN / LED_OUT / 5V / GND / SW_15 | GND / 5V_ARD / MUX_D / MUX_C / MUX_B / MUX_A / MUX_2 | R_LEDSTR | SWPad 24 | SWPad 25 | SWPad 26 | SWPad 27 | SWPad 28 | SWPad 29 | SWPad 30 | SWPad 31 | SWPad 08 | SWPad 09 | SWPad 10 | SWPad 11 | SWPad 12 | SWPad 13 | SWPad 14 | SWPad 15 | J_SW_24 | J_SW_25 | J_SW_26 | J_SW_27 | J_SW_28 | J_SW_29 | J_SW_30 | J_SW_31 | J_SW_08 | J_SW_09 | J_SW_10 | J_SW_11 | J_SW_12 | J_SW_13 | J_SW_14 | J_SW_15 | GND / 5V / RX / TX | J_MIDI | J_PZ_EXT | TX / RX / RST(NC) / GND / LED_STR / MUX_A / MUX_B / MUX_C / MUX_D / LED_R / LED_G / LED_B | RAW(NC) / GND / RST(NC) / 5V_ARD / A3(NC) / MUX_2 / MUX_1 / MUX_0 / D13(NC) / D12(NC) / D11(NC) / D10(NC) | R_MIDI_0 | R_MIDI_1 | R_MIDI_2
200bmp: C:/Users/PablodMM/Google Drive/Henar #3/03_Recursos/License_3_0_Logo.bmp